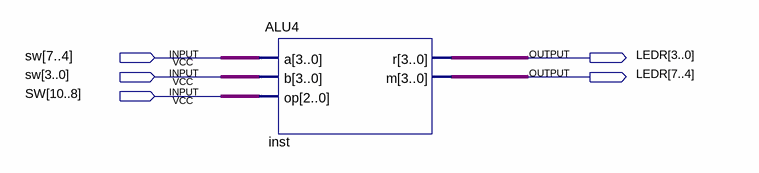
[diagram p0: schematic sheet]
// Quartus schematic ALUDemo.bdf as structural Verilog: 1 symbols, 5 pins
module ALUDemo (
  input  [10:0] sw,
  output [7:0] LEDR
);

  ALU4 inst (.a(sw[7:4]), .b(sw[3:0]), .op(sw[10:8]), .r(LEDR[3:0]), .m(LEDR[7:4]));
endmodule
